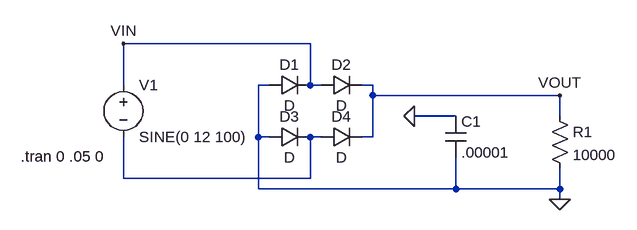
[diagram p0: schematic Full-wave.asc]
Full-wave.asc, the LTspice schematic file:
Version 4
SHEET 1 880 680
WIRE 160 16 -128 16
WIRE -128 80 -128 16
WIRE 96 80 80 80
WIRE 160 80 160 16
WIRE 176 80 160 80
WIRE 256 80 240 80
WIRE 256 96 256 80
WIRE 544 96 256 96
WIRE 384 128 320 128
WIRE 544 128 544 96
WIRE 80 160 80 80
WIRE 96 160 80 160
WIRE 176 160 160 160
WIRE 256 160 256 96
WIRE 256 160 240 160
WIRE -128 224 -128 160
WIRE 160 224 160 160
WIRE 160 224 -128 224
WIRE 80 240 80 160
WIRE 384 240 384 192
WIRE 384 240 80 240
WIRE 544 240 544 208
WIRE 544 240 384 240
WIRE 544 256 544 240
FLAG -128 16 VIN
FLAG 544 96 VOUT
FLAG 544 256 0
FLAG 320 128 0
SYMBOL diode 96 96 R270
WINDOW 0 32 32 VTop 0
WINDOW 3 0 32 VBottom 0
SYMATTR InstName D1
SYMBOL diode 176 96 R270
WINDOW 0 32 32 VTop 0
WINDOW 3 0 32 VBottom 0
SYMATTR InstName D2
SYMBOL diode 96 176 R270
WINDOW 0 32 32 VTop 0
WINDOW 3 0 32 VBottom 0
SYMATTR InstName D3
SYMBOL diode 176 176 R270
WINDOW 0 32 32 VTop 0
WINDOW 3 0 32 VBottom 0
SYMATTR InstName D4
SYMBOL res 528 112 R0
SYMATTR InstName R1
SYMATTR Value 10000
SYMBOL voltage -128 64 R0
WINDOW 123 0 0 Left 0
WINDOW 39 0 0 Left 0
SYMATTR InstName V1
SYMATTR Value SINE(0 12 100)
SYMBOL cap 368 128 R0
SYMATTR InstName C1
SYMATTR Value .00001
TEXT -286 190 Left 0 !.tran 0 .05 0

The netlist it stands for:
* Full-wave.asc
D1 0 VIN D
D2 VIN VOUT D
D3 0 N001 D
D4 N001 VOUT D
R1 VOUT 0 10000
V1 VIN N001 SINE(0 12 100)
C1 0 0 .00001
.model D D
.lib standard.dio
.tran 0 .05 0
.backanno
.end

* Results of the author's LTspice run, read from the files saved beside the schematic
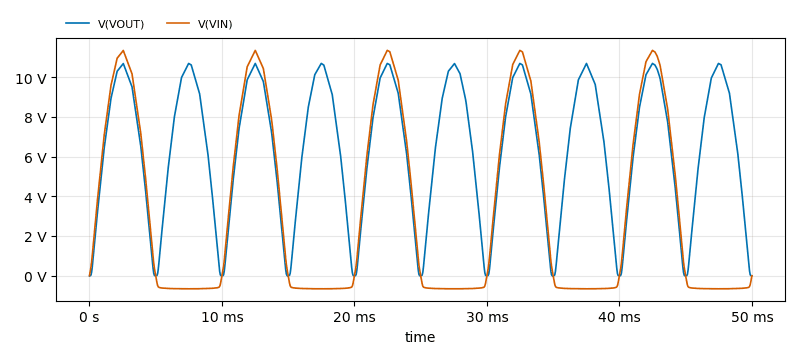
[diagram p1: Transient Analysis of Full-wave.asc, plotted from the saved traces]
* Transient Analysis, 1 run:
*   V(VOUT): min 0 V, max 10.68 V, average 6.338 V, rms 7.302 V, last 0 V
*   V(VIN): min -656.8 mV, max 11.34 V, average 3.169 V, rms 5.582 V, last 0 V